# EAGLE design CAN-breakout-v2 (EAGLE 7.5.0)
DATABASE: /home/monkbroc/Electronics/eagle/PARTSDB.tsv
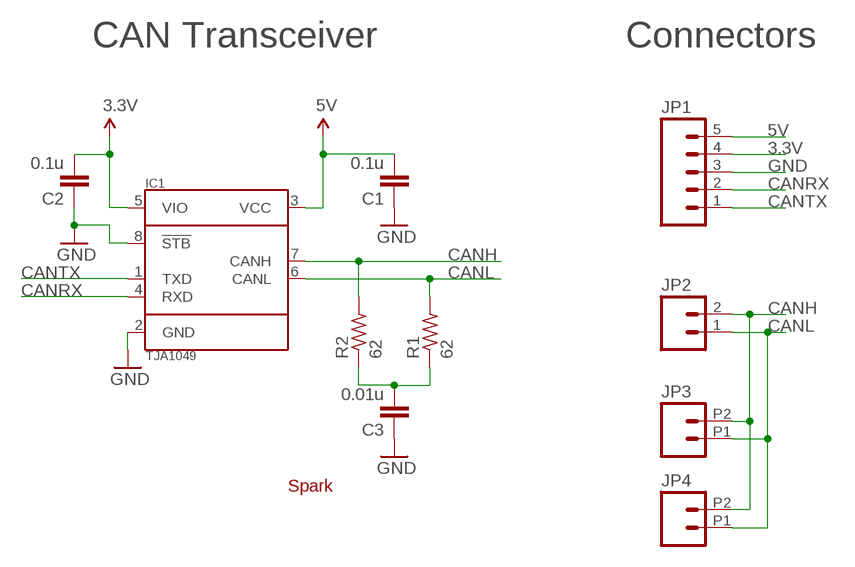
[diagram p0: schematic, sheet 1]

## Parts
C1  0.1u  C-EUC1206  [C1206]
C2  0.1u  C-EUC1206  [C1206]
C3  0.01u  C-EUC1206  [C1206]
IC1  TJA1049  [SO8]
JP1  M05PTH  [1X05]
JP2  M02PTH  [1X02]
JP3  M022.54MM_SCREWTERM  [1X02_2.54_SCREWTERM]
JP4  M022.54MM_SCREWTERM  [1X02_2.54_SCREWTERM]
R1  62  R-US_R1206  [R1206]
R2  62  R-US_R1206  [R1206]
U$3  SPARK_LOGO2  [SPARK_LOGO2]

## Nets
3.3V: C2.2 IC1.5(VIO) JP1.4
5V: C1.2 IC1.3(VCC) JP1.5
CANH: IC1.7(CANH) JP2.2 JP3.P2 JP4.P2 R2.2
CANL: IC1.6(CANL) JP2.1 JP3.P1 JP4.P1 R1.2
CANRX: IC1.4(RXD) JP1.2
CANTX: IC1.1(TXD) JP1.1
GND: C1.1 C2.1 C3.1 IC1.2(GND) IC1.8(!STB) JP1.3
N$7: C3.2 R1.1 R2.1

## Notes on the sheet
- CAN Transceiver | Connectors

## Library data of the parts
C1 C2 = rcl:C-EU: CAPACITOR, European symbol; PARTNO: 12065C104KAT2A
C3 = rcl:C-EU: CAPACITOR, European symbol; PARTNO: 12065C103KAT2A
IC1 = MuniRent:TJA1049; PARTNO: TJA1049T-118
JP1 = SparkFun-Connectors:M05: Header 5 Standard 5-pin 0.1" header. Use with straight break away headers (SKU : PRT-00116), right angle break away headers (PRT-00553), swiss pins (PRT-00743), machine pins (PRT-00117), and female headers (PRT-00115). Molex polarized connector foot print use with SKU : PRT-08230 with associated crimp pins and housings.; PARTNO: PREC005SAAN-RC
JP2 = SparkFun-Connectors:M02: Standard 2-pin 0.1" header. Use with - straight break away headers ( PRT-00116) - right angle break away headers (PRT-00553) - swiss pins (PRT-00743) - machine pins (PRT-00117) - female headers (PRT-00115) Molex polarized connector foot print use with: PRT-08233 with associated crimp pins and housings. 2.54_SCREWTERM for use with PRT-10571. 3.5mm Screw Terminal footprints for PRT-08084 5mm Screw Terminal footprints for use with PRT-08432; PARTNO: PREC002SAAN-RC
JP3 JP4 = SparkFun-Connectors:M02: Standard 2-pin 0.1" header. Use with - straight break away headers ( PRT-00116) - right angle break away headers (PRT-00553) - swiss pins (PRT-00743) - machine pins (PRT-00117) - female headers (PRT-00115) Molex polarized connector foot print use with: PRT-08233 with associated crimp pins and housings. 2.54_SCREWTERM for use with PRT-10571. 3.5mm Screw Terminal footprints for PRT-08084 5mm Screw Terminal footprints for use with PRT-08432; PARTNO: OSTVN02A150
R1 R2 = rcl:R-US_: RESISTOR, American symbol; PARTNO: RC1206FR-0762RL
U$3 = Spark:SPARK_LOGO2; BOM: EXCLUDE

## Net classes
0 default: width 0.254 mm
1 power: width 0.813 mm, clearance 0.406 mm

## Board
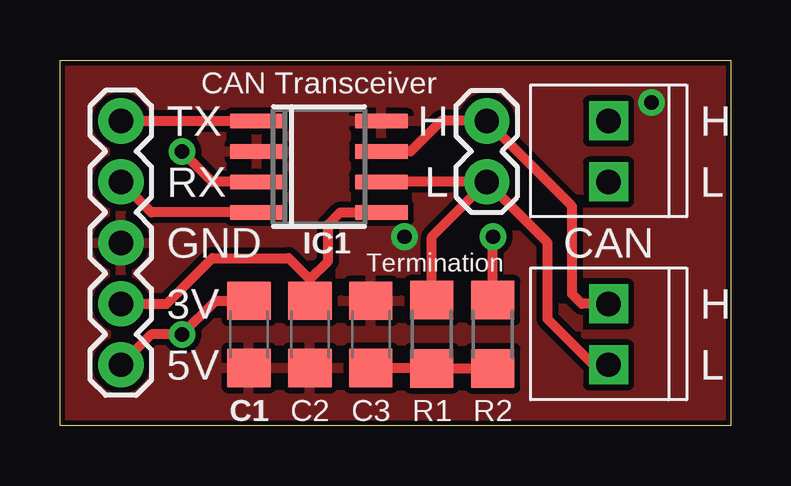
[diagram p1: board, top side]
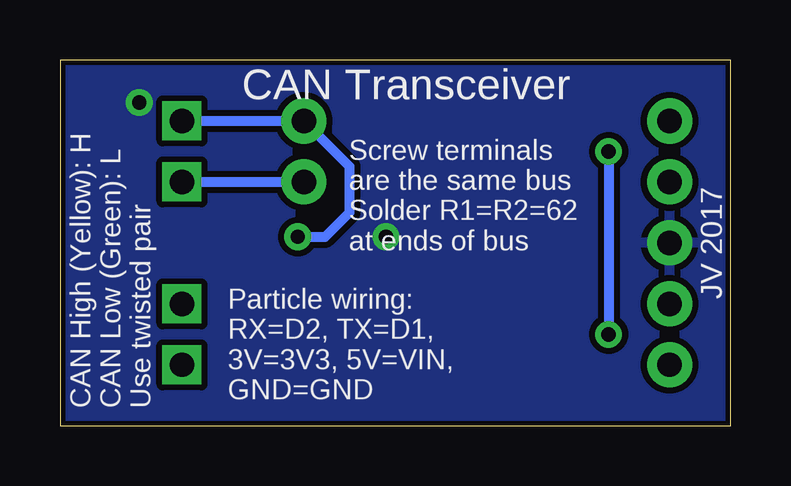
[diagram p2: board, bottom side, seen from below]

Size 27.94 x 15.24 mm. Coordinates in mm from the lower left corner, seen from the top.
Outline: 0,15.24 27.94,15.24 27.94,0 0,0 0,15.24
Copper layers (1*16): Top 0.035mm / dielectric 1.5mm / Bottom 0.035mm
Design rules "SparkFun *": minimum track width 8mil, minimum drill 20mil, track to track 10mil, track to pad 8mil, pad to pad 10mil, via to via 10mil, smd to smd 10mil, copper to edge 8mil, drill to drill 8mil, minimum pad ring 12mil, minimum via ring 10mil, stop-mask expansion 4mil, vias tented up to drill 25mil, thermal gap 10mil

### Footprints (pad centres in the part's own frame; a part is rotated, then mirrored left to right if it is on the bottom)
C1206 = smd 1.6 x 1.8: 1 -1.4,0; 2 1.4,0
SO8 = smd 0.6 x 2.2: 1 -1.905,-2.6; 2 -0.635,-2.6; 3 0.635,-2.6; 4 1.905,-2.6; 5 1.905,2.6; 6 0.635,2.6; 7 -0.635,2.6; 8 -1.905,2.6
1X05 = drill 1.016 pad 1.88: 1 0,0; 2 2.54,0; 3 5.08,0; 4 7.62,0; 5 10.16,0
1X02 = drill 1.016 pad 1.88: 1 0,0; 2 2.54,0
1X02_2.54_SCREWTERM = drill 1.016 square: P1 2.54,0; P2 0,0
R1206 = smd 1.6 x 1.803: 1 -1.422,0; 2 1.422,0

### Placement (x,y rotation side)
C1  7.87,3.81 90 top
C2  10.41,3.81 90 top
C3  12.95,3.81 270 top
IC1  10.79,10.79 270 top
JP1  2.54,12.7 270 top
JP2  17.78,10.16 90 top
JP3  22.86,5.08 270 top
JP4  22.86,12.7 270 top
R1  15.49,3.81 90 top
R2  18.03,3.81 90 top
U$3  9.7,3.35 0 bottom

### Tracks (layer width: path | path; a pad name or v marks a point on that pad's centre or on a via)
3.3V
  Top 0.406: IC1.5 13.34,8.89 | JP1.4 4.45,5.08 6.35,6.99 9.53,6.99 10.41,6.1 | 13.34,8.83 IC1.5 | 10.41,6.1 C2.2 | 10.41,6.1 11.18,6.86 11.18,8.38 11.68,8.89 IC1.5
5V  (via drill 0.6)
  Top 0.406: IC1.3 6.35,10.16 v5.08,11.43 | JP1.5 3.81,3.81 v5.08,3.81 6.48,5.21 C1.2
  Bottom 0.406: v5.08,11.43 v5.08,3.81
CANH  (via drill 0.6)
  Top 0.406: IC1.7 14.61,11.43 15.88,12.7 JP2.2 21.34,9.14 21.34,5.49 21.74,5.08 JP3.P2 | R2.2 v18.03,7.87
  Bottom 0.406: JP4.P2 JP2.2 15.88,10.79 15.88,8.89 16.89,7.87 v18.03,7.87
CANL
  Top 0.406: JP3.P1 22.23,2.54 20.32,4.45 20.32,7.62 JP2.1 | JP2.1 IC1.6 | R1.2 15.49,7.87 JP2.1
  Bottom 0.406: JP4.P1 JP2.1
CANRX
  Top 0.406: IC1.4 3.81,8.89 JP1.2
CANTX
  Top 0.406: JP1.1 IC1.1
GND  (via drill 0.6)
  other vias: 14.35,7.87 24.64,13.46
  pour Top: 0,15.24 27.94,15.24 27.94,0 0,0
  pour Bottom: 0,15.24 27.94,15.24 27.94,0 0,0
N$7
  Top 0.406: C3.2 15.49,2.41 R1.1 R2.1

### Text on the board
tPlace: CAN Transceiver | TX | H | H | RX | L | L | GND | CAN | Termination | 3V | H | 5V | L
bPlace: CAN Transceiver | Screw terminals / are the same bus / Solder R1=R2=62 / at ends of bus | JV 2017 | Particle wiring: / RX=D2, TX=D1, / 3V=3V3, 5V=VIN, / GND=GND | CAN High (Yellow): H / CAN Low (Green): L / Use twisted pair
bStop: V2
Document: Revision 1 | Julien Vanier | jvanier@gmail.com